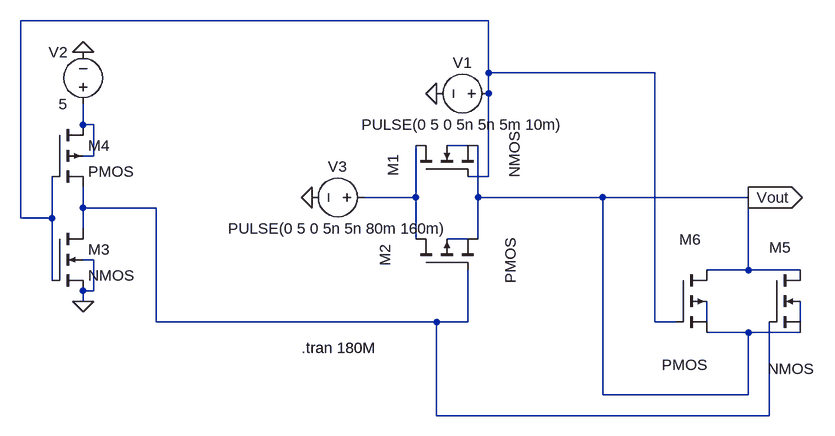
[diagram p0: schematic D-latch.asc]
D-latch.asc, the LTspice schematic file:
Version 4
SHEET 1 928 680
WIRE 208 -144 -512 -144
WIRE 208 -64 208 -144
WIRE 464 -64 208 -64
WIRE 208 -32 208 -64
WIRE -416 16 -416 -16
WIRE -400 16 -416 16
WIRE 176 48 144 48
WIRE -400 64 -400 16
WIRE -400 64 -416 64
WIRE 208 96 208 -32
WIRE 208 96 176 96
WIRE 96 128 96 48
WIRE 96 128 16 128
WIRE 192 128 192 48
WIRE 384 128 192 128
WIRE 608 128 384 128
WIRE -416 144 -416 112
WIRE -304 144 -416 144
WIRE -512 160 -512 -144
WIRE -464 160 -464 96
WIRE -464 160 -512 160
WIRE -416 176 -416 144
WIRE 96 192 96 128
WIRE 176 192 144 192
WIRE 192 192 192 128
WIRE -400 224 -416 224
WIRE 608 240 608 128
WIRE 608 240 544 240
WIRE 688 240 608 240
WIRE -464 256 -464 160
WIRE -400 272 -400 224
WIRE -400 272 -416 272
WIRE -416 288 -416 272
WIRE -304 320 -304 144
WIRE 128 320 -304 320
WIRE 176 320 176 240
WIRE 176 320 128 320
WIRE 464 320 464 -64
WIRE 496 320 464 320
WIRE 544 320 544 288
WIRE 688 320 688 288
WIRE 608 336 544 336
WIRE 688 336 608 336
WIRE 384 432 384 128
WIRE 608 432 608 336
WIRE 608 432 384 432
WIRE 128 464 128 320
WIRE 640 464 640 320
WIRE 640 464 128 464
FLAG 128 -32 0
FLAG -64 128 0
FLAG -416 288 0
FLAG -416 -96 0
FLAG 608 128 Vout
IOPIN 608 128 Out
SYMBOL nmos4 96 96 R270
WINDOW 0 0 -35 Left 2
WINDOW 3 -2 152 Left 2
SYMATTR InstName M1
SYMBOL pmos4 96 240 R270
WINDOW 0 6 -47 Left 2
WINDOW 3 -21 146 Left 2
SYMATTR InstName M2
SYMBOL voltage 224 -32 R90
WINDOW 0 -32 56 VBottom 2
WINDOW 3 32 56 VTop 2
WINDOW 123 0 0 Left 0
WINDOW 39 0 0 Left 0
SYMATTR InstName V1
SYMATTR Value PULSE(0 5 0 5n 5n 5m 10m)
SYMBOL voltage 32 128 R90
WINDOW 0 -32 56 VBottom 2
WINDOW 3 32 56 VTop 2
WINDOW 123 0 0 Left 0
WINDOW 39 0 0 Left 0
SYMATTR InstName V3
SYMATTR Value PULSE(0 5 0 5n 5n 80m 160m)
SYMBOL nmos4 -464 176 R0
SYMATTR InstName M3
SYMBOL pmos4 -464 16 R0
SYMATTR InstName M4
SYMBOL voltage -416 0 R180
WINDOW 0 24 96 Left 2
WINDOW 3 24 16 Left 2
WINDOW 123 0 0 Left 0
WINDOW 39 0 0 Left 0
SYMATTR InstName V2
SYMATTR Value 5
SYMBOL nmos4 640 240 R0
WINDOW 0 0 -35 Left 2
WINDOW 3 -2 152 Left 2
SYMATTR InstName M5
SYMBOL pmos4 496 240 R0
WINDOW 0 6 -47 Left 2
WINDOW 3 -21 146 Left 2
SYMATTR InstName M6
TEXT -80 360 Left 2 !.tran 180M

The netlist it stands for:
* D-latch.asc
M1 N004 N001 Vout N003 NMOS
M2 N004 N005 Vout N006 PMOS
V1 N001 0 PULSE(0 5 0 5n 5n 5m 10m)
V3 N004 0 PULSE(0 5 0 5n 5n 80m 160m)
M3 N005 N001 0 0 NMOS
M4 N002 N001 N005 N002 PMOS
V2 N002 0 5
M5 Vout N005 Vout N008 NMOS
M6 Vout N001 Vout N007 PMOS
.model NMOS NMOS
.model PMOS PMOS
.lib standard.mos
.tran 180M
.backanno
.end